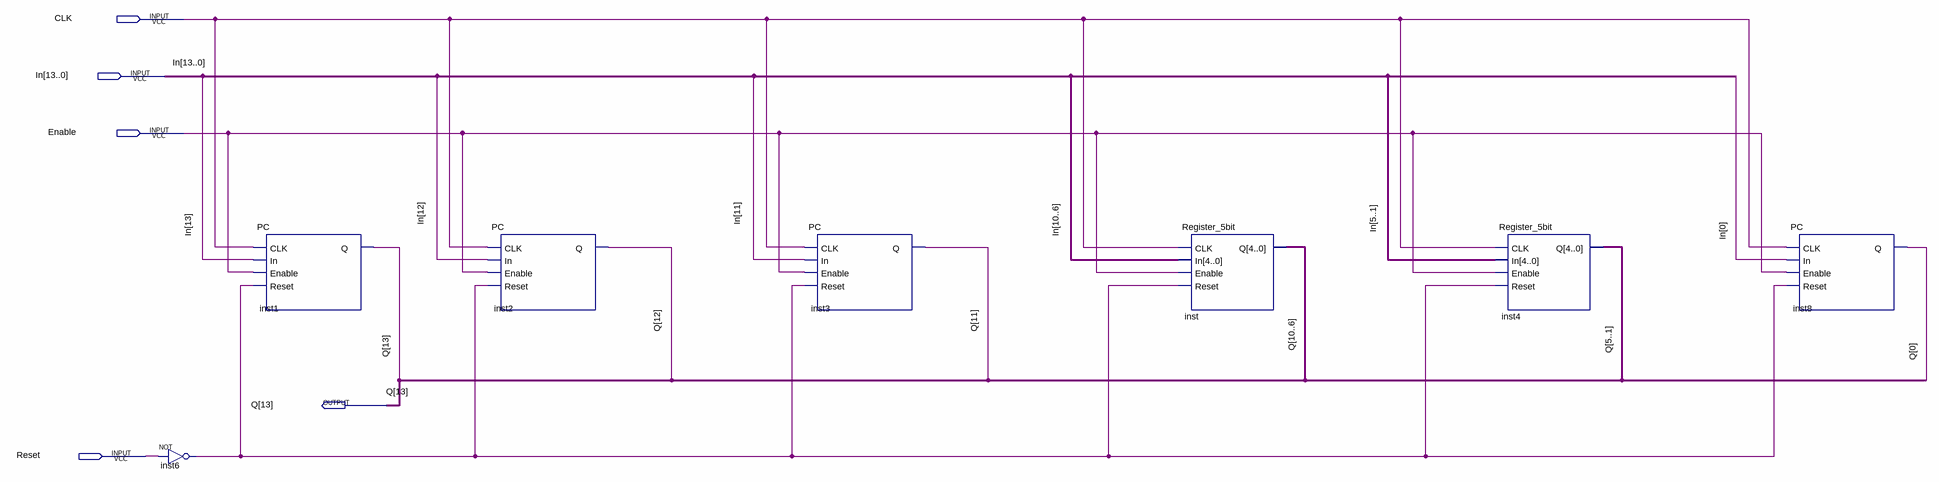
[diagram p0: schematic sheet]
// Quartus schematic Register_14bit.bdf as structural Verilog: 7 symbols, 5 pins
module Register_14bit (
  input  CLK,
  input  [13:0] In,
  input  Enable,
  input  Reset,
  output [13:0] Q
);

  wire inst6_out;

  not inst6 (inst6_out, Reset);
  PC inst1 (.CLK(CLK), .In(In[13]), .Enable(Enable), .Reset(inst6_out), .Q(Q[13]));
  PC inst2 (.CLK(CLK), .In(In[12]), .Enable(Enable), .Reset(inst6_out), .Q(Q[12]));
  PC inst3 (.CLK(CLK), .In(In[11]), .Enable(Enable), .Reset(inst6_out), .Q(Q[11]));
  Register_5bit inst (.CLK(CLK), .In(In[10:6]), .Enable(Enable), .Reset(inst6_out), .Q(Q[10:6]));
  Register_5bit inst4 (.CLK(CLK), .In(In[5:1]), .Enable(Enable), .Reset(inst6_out), .Q(Q[5:1]));
  PC inst8 (.CLK(CLK), .In(In[0]), .Enable(Enable), .Reset(inst6_out), .Q(Q[0]));
endmodule
